# EAGLE design transistor (EAGLE 6.6.0)
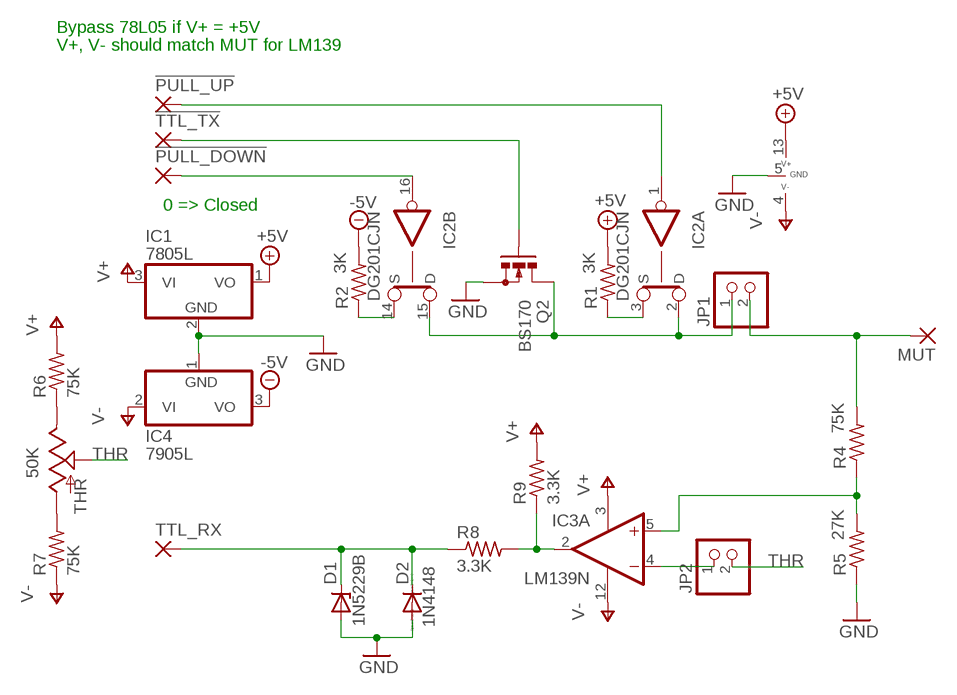
[diagram p0: schematic, sheet 1]

## Parts
!PULL_DOWN  1,6/0,9  [1,6/0,9]
!PULL_UP  1,6/0,9  [1,6/0,9]
!TTL_TX  1,6/0,9  [1,6/0,9]
D1  1N5229B  ZENER-DIODEDO35Z10  [DO35Z10]
D2  1N4148  1N4148DO35-10  [DO35-10]
IC1  7805L  [TO92]
IC2  DG201CJN  [DIL16]
IC3  LM139N  LM339N  [DIL14]
IC4  7905L  [TO92]
JP1  PINHD-1X2  [1X02]
JP2  PINHD-1X2  [1X02]
MUT  1,6/0,9  [1,6/0,9]
Q2  BS170  [SOT54E]
R1  3K  R-US_0207/10  [0207/10]
R2  3K  R-US_0207/10  [0207/10]
R4  75K  R-US_0207/10  [0207/10]
R5  27K  R-US_0207/10  [0207/10]
R6  75K  R-US_0207/10  [0207/10]
R7  75K  R-US_0207/10  [0207/10]
R8  3.3K  R-US_0207/10  [0207/10]
R9  3.3K  R-US_0207/10  [0207/10]
THR  50K  TRIM_US-S43P  [SP19L]
TTL_RX  1,6/0,9  [1,6/0,9]

## Nets
+5V: IC1.1(VO) IC2.13(P:V+) R1.2
-5V: IC4.3(VO) R2.2
GND: D1.A D2.A IC1.2(GND) IC2.5(P:GND) IC4.1(GND) Q2.S R5.1
N$1: IC2.3(A:S) R1.1
N$2: IC2.14(B:S) R2.1
N$3: !TTL_TX.1(P) Q2.G
N$4: !PULL_DOWN.1(P) IC2.16(B:IN)
N$5: IC2.2(A:D) IC2.15(B:D) JP1.1 Q2.D
N$6: JP1.2 MUT.1(P) R4.2
N$7: IC3.5(A:+IN) R4.1 R5.2
N$8: IC3.4(A:-IN) JP2.1
N$9: IC3.2(A:OUT) R8.2 R9.1
N$10: !PULL_UP.1(P) IC2.1(A:IN)
N$12: D1.C D2.C R8.1 TTL_RX.1(P)
N$13: R6.1 THR.E
N$14: R7.2 THR.A
THR: JP2.2 THR.S
V+: IC1.3(VI) IC3.3(P:V+) R6.2 R9.2
V-: IC2.4(P:V-) IC3.12(P:GND) IC4.2(VI) R7.1
Unconnected: IC2.6(D:S) IC2.7(D:D) IC2.8(D:IN) IC2.9(C:IN) IC2.10(C:D) IC2.11(C:S) IC3.1(B:OUT) IC3.6(B:-IN) IC3.7(B:+IN) IC3.8(C:-IN) IC3.9(C:+IN) IC3.10(D:-IN) IC3.11(D:+IN) IC3.13(D:OUT) IC3.14(C:OUT)

## Notes on the sheet
- Bypass 78L05 if V+ = +5V
- V+, V- should match MUT for LM139
- 0 => Closed

## Library data of the parts
!PULL_DOWN !PULL_UP !TTL_TX MUT TTL_RX = wirepad:1,6/0,9: THROUGH-HOLE PAD
D1 = diode:ZENER-DIODE: Z-Diode
D2 = diode:1N4148: DIODE high speed (Philips)
IC1 = linear:78*: Positive VOLTAGE REGULATOR Source: http://cache.national.com/ds/LM/LM78L05.pdf http://www.fairchildsemi.com/ds/LM/LM7805.pdf
IC2 = linear:DG201CJ: CMOS SWITCH
IC3 = linear:LM339: Low Power Low Offset Voltage Quad Comparators with open collector; LM139/LM239/LM339/LM2901/LM3302
IC4 = linear:79*: Negative VOLTAGE REGULATOR
JP1 JP2 = pinhead:PINHD-1X2: PIN HEADER
Q2 = transistor-small-signal:BS170: N-CHANNEL MOS FET
R1 R2 R4-R9 = rcl:R-US_: RESISTOR, American symbol
THR = pot:TRIM_US-: POTENTIOMETER

## Board
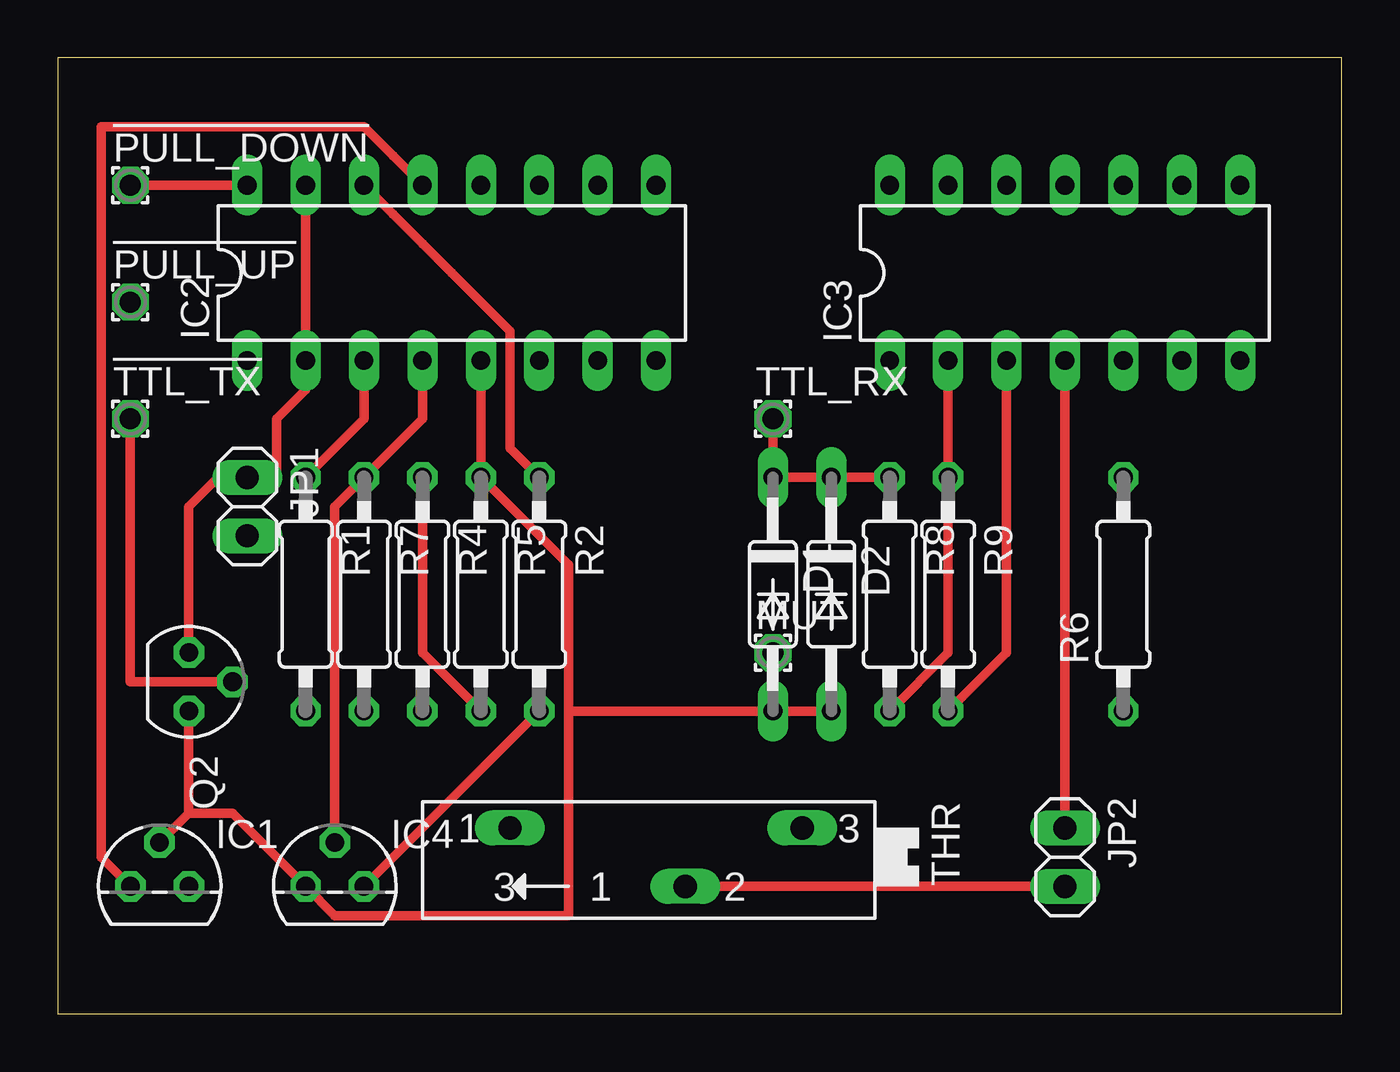
[diagram p1: board, top side]
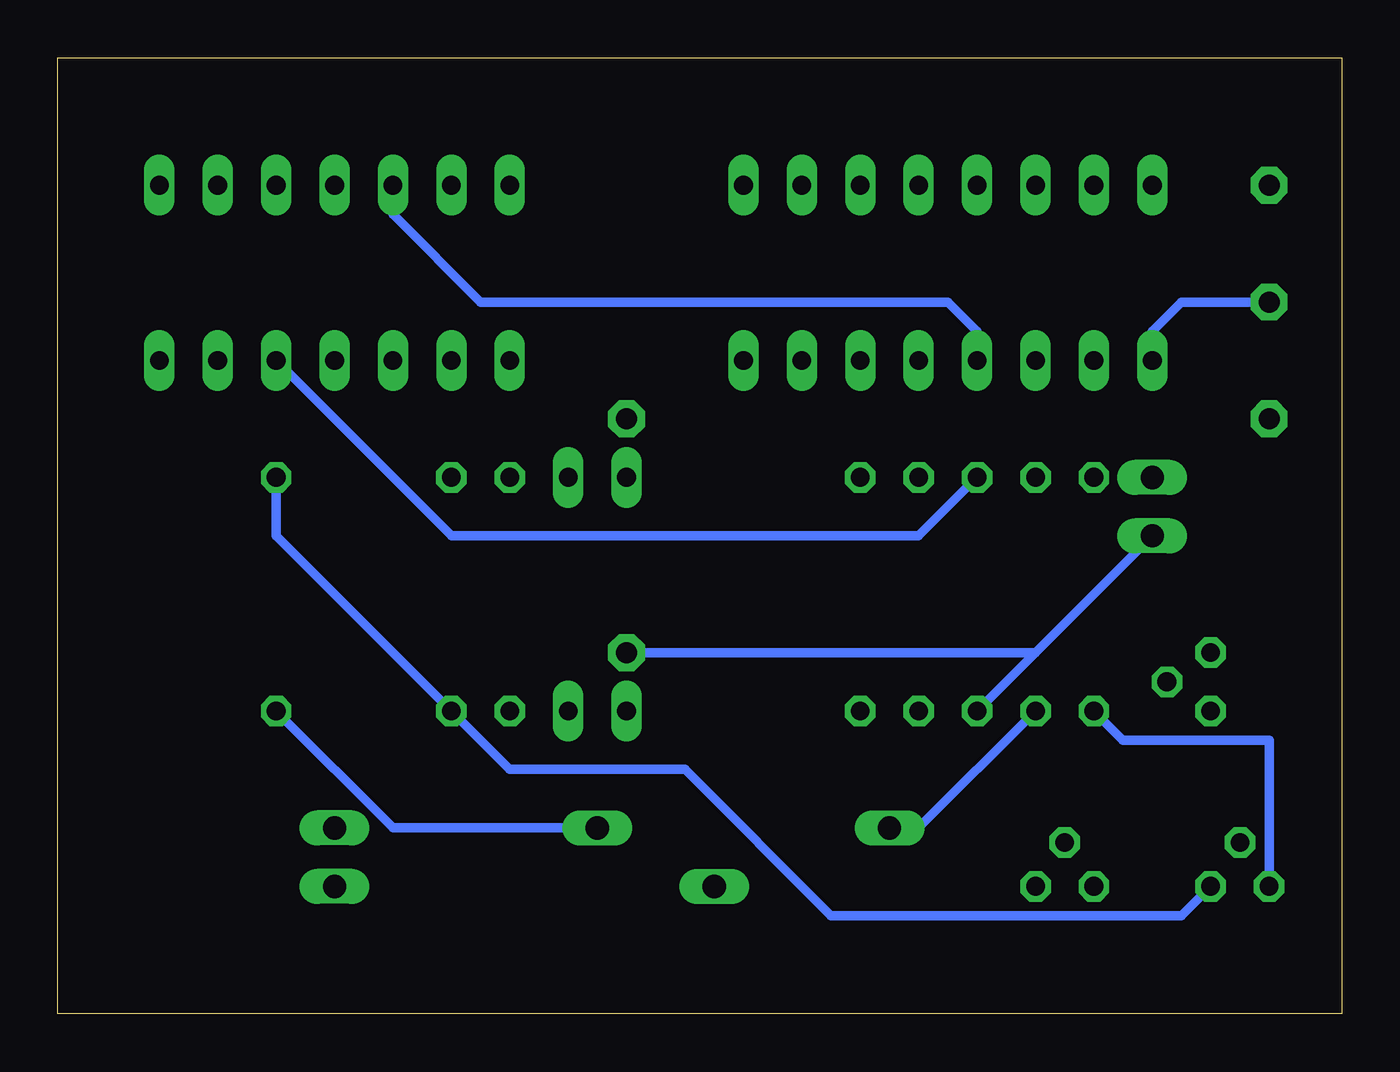
[diagram p2: board, bottom side, seen from below]

Size 55.86 x 41.58 mm. Coordinates in mm from the lower left corner, seen from the top.
Outline: 0,0 55.86,0 55.86,41.58 0,41.58 0,0
Copper layers (1+16): Top 0.035mm / dielectric 1.5mm / Bottom 0.035mm
Design rules "16mils": minimum track width 16mil, minimum drill 32mil, track to track 15mil, track to pad 10mil, pad to pad 10mil, via to via 10mil, smd to smd 10mil, copper to edge 13mil, drill to drill 10mil, minimum pad ring 10mil, minimum via ring 8mil, stop-mask expansion 0mil, vias tented up to drill 0mil, thermal gap 10mil

### Footprints (pad centres in the part's own frame; a part is rotated, then mirrored left to right if it is on the bottom)
1,6/0,9 = drill 0.914 pad 1.6 octagon: 1 0,0
DO35Z10 = drill 0.813 long: A 5.08,0; C -5.08,0
DO35-10 = drill 0.813 long: A 5.08,0; C -5.08,0
TO92 = drill 0.813 octagon: 1 -1.27,0; 2 0,1.905; 3 1.27,0
DIL16 = drill 0.813 long: 1 -8.89,-3.81; 2 -6.35,-3.81; 3 -3.81,-3.81; 4 -1.27,-3.81; 5 1.27,-3.81; 6 3.81,-3.81; 7 6.35,-3.81; 8 8.89,-3.81; 9 8.89,3.81; 10 6.35,3.81; 11 3.81,3.81; 12 1.27,3.81; 13 -1.27,3.81; 14 -3.81,3.81; 15 -6.35,3.81; 16 -8.89,3.81
DIL14 = drill 0.813 long: 1 -7.62,-3.81; 2 -5.08,-3.81; 3 -2.54,-3.81; 4 0,-3.81; 5 2.54,-3.81; 6 5.08,-3.81; 7 7.62,-3.81; 8 7.62,3.81; 9 5.08,3.81; 10 2.54,3.81; 11 0,3.81; 12 -2.54,3.81; 13 -5.08,3.81; 14 -7.62,3.81
1X02 = drill 1.016 long: 1 -1.27,0; 2 1.27,0
SOT54E = drill 0.813 octagon: D -1.27,0; G 0,1.905; S 1.27,0
0207/10 = drill 0.813 octagon: 1 -5.08,0; 2 5.08,0
SP19L = drill 1.016 long: A 5.715,-1.27; E -6.985,-1.27; S -1.905,1.27

### Placement (x,y rotation side)
!PULL_DOWN  3.17,36.03 0 top
!PULL_UP  3.17,30.95 0 top
!TTL_TX  3.17,25.87 0 top
D1  31.11,18.25 270 top
D2  33.65,18.25 270 top
IC1  4.44,5.55 0 top
IC2  17.14,32.22 0 top
IC3  43.81,32.22 0 top
IC4  12.06,5.55 0 top
JP1  8.25,22.06 270 top
JP2  43.81,6.82 270 top
MUT  31.11,15.71 0 top
Q2  5.71,14.44 270 top
R1  10.79,18.25 270 top
R2  20.95,18.25 270 top
R4  15.87,18.25 270 top
R5  18.41,18.25 270 top
R6  46.35,18.25 90 top
R7  13.33,18.25 270 top
R8  36.19,18.25 270 top
R9  38.73,18.25 270 top
THR  25.39,6.82 180 top
TTL_RX  31.11,25.87 0 top

### Tracks (layer width: path | path; a pad name or v marks a point on that pad's centre or on a via)
+5V
  Top 0.406: IC1.1 1.9,6.82 1.9,38.57 13.33,38.57 14.6,37.3 IC2.13
  Bottom 0.406: IC1.1 3.17,11.9 9.52,11.9 R1.2
-5V
  Top 0.406: IC4.3 R2.2
GND
  Top 0.406: D2.A D1.A 29.84,13.17 22.22,13.17 | IC2.5 18.41,27.14 R5.1 22.22,19.52 22.22,13.17 | 22.22,13.17 22.22,4.28 12.06,4.28 IC4.1 7.62,8.73 5.71,8.73 | 5.71,8.73 5.08,8.09 IC1.2 | 5.71,8.73 Q2.S
N$1
  Top 0.406: R1.1 13.33,25.87 13.33,27.14 IC2.3
N$2
  Top 0.406: R2.1 19.68,24.6 19.68,29.68 17.14,32.22 15.87,33.49 14.6,34.76 IC2.14
N$3
  Top 0.406: !TTL_TX.1 3.17,14.44 6.98,14.44 Q2.G
N$4
  Top 0.406: !PULL_DOWN.1 IC2.16
N$5
  Top 0.406: IC2.15 10.79,34.76 10.79,29.68 IC2.2 10.79,27.14 9.52,25.87 9.52,23.33 JP1.1 6.98,23.33 5.71,22.06 5.71,18.25 Q2.D
N$6
  Bottom 0.406: 13.33,15.71 JP1.2 | R4.2 13.33,15.71 | 13.33,15.71 MUT.1
N$7
  Top 0.406: R5.2 15.87,15.71 R4.1
  Bottom 0.406: IC3.5 38.73,20.79 18.41,20.79 R4.1
N$8
  Top 0.406: JP2.1 43.81,27.14 IC3.4
N$9
  Top 0.406: R8.2 38.73,15.71 R9.1 38.73,27.14 IC3.2
N$10
  Bottom 0.406: !PULL_UP.1 6.98,30.95 8.25,29.68 IC2.1
N$12
  Top 0.406: TTL_RX.1 31.11,24.6 D1.C D2.C R8.1
N$13
  Bottom 0.406: R6.1 41.27,8.09 33.65,8.09 THR.E
N$14
  Bottom 0.406: R7.2 18.41,8.09 THR.A
THR
  Top 0.406: THR.S 28.57,5.55 42.54,5.55 JP2.2
V+
  Top 0.406: R9.2 41.27,15.71 41.27,27.14 IC3.3
  Bottom 0.406: IC1.3 6.98,4.28 22.22,4.28 28.57,10.63 36.19,10.63 R9.2 46.35,20.79 R6.2
V-
  Top 0.406: IC4.2 12.06,8.09 12.06,22.06 R7.1 15.87,25.87 IC2.4
  Bottom 0.406: IC3.12 41.27,34.76 37.46,30.95 17.14,30.95 15.87,29.68 IC2.4